# Altium project DT35_DataACQ_F3.PrjPcb
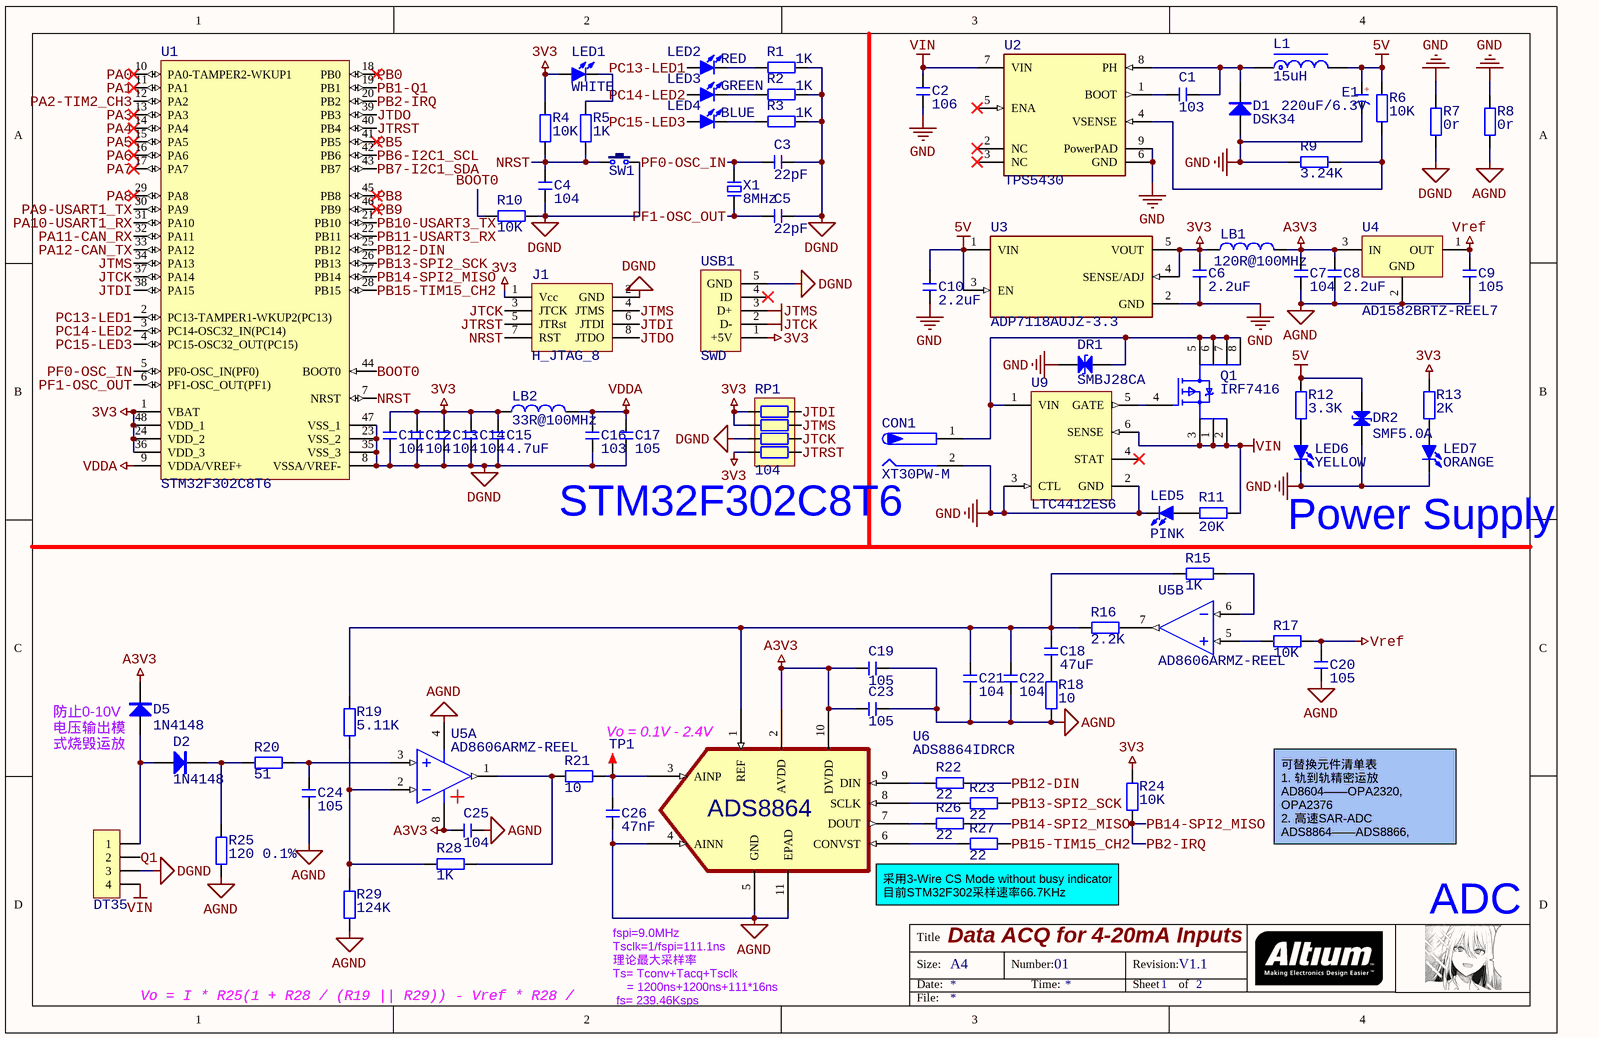
[diagram p0: Single_Supply_ADC_V1.1.SchDoc]
2 sheets, 122 parts. Net scope: global (net labels, ports and power ports of the same name join across sheets).
Board file: DT35_ACQ_F3_V1.2.PcbDoc
Sheets:
  Single_Supply_ADC_V1.1.SchDoc
  Communication_V1.1.SchDoc

## Sheet Single_Supply_ADC_V1.1.SchDoc: Data ACQ for 4-20mA Inputs
size A4; DrawnBy: Lin; Engineer: Lin; DocumentNumber: 01; Revision: V1.1; SheetNumber: 1; SheetTotal: 2

### Parts
C1  103  [C 0603_L]
C2  106  [C 0805_L]
C3  22pF  [C 0603_L]
C4  104  [C 0603_L]
C5  22pF  [C 0603_L]
C6  2.2uF  [C 0603_L]
C7  104  [C 0603_L]
C8  2.2uF  [C 0603_L]
C9  105  [C 0603_L]
C10  2.2uF  [C 0603_L]
C11  104  [C 0603_L]
C12  104  [C 0603_L]
C13  104  [C 0603_L]
C14  104  [C 0603_L]
C15  4.7uF  [C 0603_L]
C16  103  [C 0603_L]
C17  105  [C 0603_L]
C18  47uF  [C 0603_L]
C19  105  [C 0603_L]
C20  105  [C 0603_L]
C21  104  [C 0603_L]
C22  104  [C 0603_L]
C23  105  [C 0603_L]
C24  105  [C 0603_L]
C25  104  [C 0603_L]
C26  47nF  [C 0603_L]
CON1  XT30PW-M  [XT30PW-M]
D1  DSK34  [SOD-123]
D2  1N4148  [SOD-123]
D5  1N4148  [SOD-123]
DR1  SMBJ28CA  [SMB]
DR2  SMF5.0A  [SOD-323]
DT35  HDR-1X4  [XH2.54-LS-4P]  (value not drawn)
E1  220uF/6.3V  [CD B(3528)]
J1  H_JTAG_8  [IDC2.54-LI-2x4P]
L1  15uH  [NR4020]
LB1  120R@100MHz  [FB 0603_L]
LB2  33R@100MHz  [FB 0603_L]
LED1  WHITE  [LED 0603W]
LED2  RED  [LED 0603R]
LED3  GREEN  [LED 0603G]
LED4  BLUE  [LED 0603B]
LED5  PINK  [LED 0603R]
LED6  YELLOW  [LED 0603R]
LED7  ORANGE  [LED 0603R]
Q1  IRF7416  [SOP8_L]
R1  1K  [R 0603_L]
R2  1K  [R 0603_L]
R3  1K  [R 0603_L]
R4  10K  [R 0603_L]
R5  1K  [R 0603_L]
R6  10K  [R 0603_L]
R7  0r  [R 0603_L]
R8  0r  [R 0603_L]
R9  3.24K  [R 0603_L]
R10  10K  [R 0603_L]
R11  20K  [R 0603_L]
R12  3.3K  [R 0603_L]
R13  2K  [R 0603_L]
R15  1K  [R 0603_L]
R16  2.2K  [R 0603_L]
R17  10K  [R 0603_L]
R18  10  [R 0603_L]
R19  5.11K  [R 0603_L]
R20  51  [R 0603_L]
R21  10  [R 0603_L]
R22  22  [R 0603_L]
R23  22  [R 0603_L]
R24  10K  [R 0603_L]
R25  120 0.1%  [R 0603_L]
R26  22  [R 0603_L]
R27  22  [R 0603_L]
R28  1K  [R 0603_L]
R29  124K  [R 0603_L]
RP1  104  [RCA-8P4R-0603]
SW1  6x6x5  [TS 2PIN 6x6x4.8]  (value not drawn)
TP1  (no value)  [TEST 1]
U1  STM32F302C8T6  [LQFP48 7X7_L]
U2  TPS5430  [Texas_Instruments_DDA0008J_IPC_C]
U3  ADP7118AUJZ-3.3  [Analog_Devices_Inc_UJ-5_IPC_C]
U4  AD1582BRTZ-REEL7  [SOT23-3L]
U5  AD8606ARMZ-REEL  [RM_8_ADI-L]  (parts A,B of 2)
U6  ADS8864IDRCR  [DRC10_TEX]
U9  LTC4412ES6  [Texas_Instruments_DDC0006A_0]
USB1  SWD  [USB-MICRO_C]
X1  8MHz  [OSC 5032-2P]

### Nets
3V3: C6.1 C11.2 C12.2 C13.2 C14.2 C15.2 J1.1(Vcc) LB1.1 LB2.1 LED1.1(A) R4.2 R13.2 R24.2 RP1.5 RP1.6 RP1.8 U1.1(VBAT) U1.24(VDD_2) U1.36(VDD_3) U1.48(VDD_1) U3.4(SENSE/ADJ) U3.5(VOUT) USB1.1(+5V)
5V: C10.1 DR2.2(K) E1.1(A) L1.2 R6.2 R12.2 U3.1(VIN) U3.3(EN)
A3V3: C7.1 C8.1 C19.2 C23.2 C25.2 D5.2(K) LB1.2 U4.3(IN) U5.8(+V) U6.2(AVDD) U6.10(DVDD)
AGND: C7.2 C8.2 C9.2 C19.1 C20.1 C21.1 C22.1 C23.1 C24.1 C25.1 C26.2 R8.2 R18.1 R25.1 R29.1 U4.2(GND) U5.4(-V) U6.4(AINN) U6.5(GND) U6.11(EPAD)
DGND: C3.1 C4.1 C5.1 C11.1 C12.1 C13.1 C14.1 C15.1 C16.1 C17.1 DT35.3 J1.2(GND) R1.2 R2.2 R3.2 R7.2 R10.1 RP1.7 SW1.2 U1.8(VSSA/VREF-) U1.23(VSS_2) U1.35(VSS_3) U1.47(VSS_1) USB1.5(GND)
GND: C2.1 C6.2 C10.2 CON1.2 D1.1(A) DR1.2(K) DR2.1(A) E1.2(K) LED5.2(K) LED6.2(K) LED7.2(K) R7.1 R8.1 R9.2 U2.6(GND) U2.9(PowerPAD) U3.2(GND) U9.2(GND) U9.3(CTL)
JTCK: J1.3(JTCK) RP1.2 U1.37(PA14) USB1.2(D-)
JTMS: J1.4(JTMS) RP1.3 U1.34(PA13) USB1.3(D+)
VDDA: C16.2 C17.2 LB2.2 U1.9(VDDA/VREF+)
VIN: C2.2 DT35.4 Q1.1(S) Q1.2(S) Q1.3(S) R11.1 U2.7(VIN) U9.6(SENSE)
Vref: C9.1 C20.2 R17.1 U4.1(OUT)
BOOT0: R10.2 U1.44(BOOT0)
JTDI: J1.6(JTDI) RP1.4 U1.38(PA15)
JTDO: J1.8(JTDO) U1.39(PB3)
JTRST: J1.5(JTRst) RP1.1 U1.40(PB4)
NRST: C4.2 J1.7(RST) R4.1 R5.1 SW1.1 U1.7(NRST)
PA0: U1.10(PA0-TAMPER2-WKUP1)
PA1: U1.11(PA1)
PA2-TIM2_CH3: U1.12(PA2)
PA3: U1.13(PA3)
PA4: U1.14(PA4)
PA5: U1.15(PA5)
PA6: U1.16(PA6)
PA7: U1.17(PA7)
PA8: U1.29(PA8)
PA9-USART1_TX: U1.30(PA9)
PA10-USART1_RX: U1.31(PA10)
PA11-CAN_RX: U1.32(PA11)
PA12-CAN_TX: U1.33(PA12)
PB0: U1.18(PB0)
PB1-Q1: U1.19(PB1)
PB5: U1.41(PB5)
PB6-I2C1_SCL: U1.42(PB6)
PB7-I2C1_SDA: U1.43(PB7)
PB8: U1.45(PB8)
PB9: U1.46(PB9)
PB10-USART3_TX: U1.21(PB10)
PB11-USART3_RX: U1.22(PB11)
PB12-DIN: R22.1 U1.25(PB12)
PB13-SPI2_SCK: R23.1 U1.26(PB13)
PB14-SPI2_MISO: R24.1 R26.1 U1.20(PB2) U1.27(PB14)  [also labelled PB2-IRQ]
PB15-TIM15_CH2: R27.1 U1.28(PB15)
PC13-LED1: LED2.1(A) U1.2(PC13-TAMPER1-WKUP2(PC13))
PC14-LED2: LED3.1(A) U1.3(PC14-OSC32_IN(PC14))
PC15-LED3: LED4.1(A) U1.4(PC15-OSC32_OUT(PC15))
PF0-OSC_IN: C3.2 U1.5(PF0-OSC_IN(PF0)) X1.2
PF1-OSC_OUT: C5.2 U1.6(PF1-OSC_OUT(PF1)) X1.1
Q1: DT35.2
NetC1_1: C1.1 D1.2(K) L1.1 U2.8(PH)
NetC1_2: C1.2 U2.1(BOOT)
NetC18_1: C18.1 R18.2
NetC18_2: C18.2 C21.2 C22.2 R15.2 R16.2 R19.2 U6.1(REF)
NetC24_2: C24.2 R20.1 U5.3(+IN_A)
NetC26_1: C26.1 R21.1 TP1.1 U6.3(AINP)
NetCON1_1: CON1.1 DR1.1(A) Q1.5(D) Q1.6(D) Q1.7(D) Q1.8(D) U9.1(VIN)
NetD2_1: D2.1(A) D5.1(A) DT35.1
NetD2_2: D2.2(K) R20.2 R25.2
NetLED1_2: LED1.2(K) R5.2
NetLED2_2: LED2.2(K) R1.1
NetLED3_2: LED3.2(K) R2.1
NetLED4_2: LED4.2(K) R3.1
NetLED5_1: LED5.1(A) R11.2
NetLED6_1: LED6.1(A) R12.1
NetLED7_1: LED7.1(A) R13.1
NetQ1_4: Q1.4(G) U9.5(GATE)
NetR6_1: R6.1 R9.1 U2.4(VSENSE)
NetR15_1: R15.1 U5.6(-IN_B)
NetR16_1: R16.1 U5.7(OUT_B)
NetR17_2: R17.2 U5.5(+IN_B)
NetR19_1: R19.1 R28.2 R29.2 U5.2(-IN_A)
NetR21_2: R21.2 R28.1 U5.1(OUT_A)
NetR22_2: R22.2 U6.9(DIN)
NetR23_2: R23.2 U6.8(SCLK)
NetR26_2: R26.2 U6.7(DOUT)
NetR27_2: R27.2 U6.6(CONVST)

Not connected (* = marked no-connect by the designer): U2 2(NC)* 3(NC)* 5(ENA)*; U9 4(STAT)*; USB1 4(ID)*

### Notes on the sheet
- STM32F302C8T6
- Power Supply
- (near D5) 防止0-10V电压输出模式烧毁运放
- (near U6) Vo = 0.1V - 2.4V
- 可替换元件清单表
  1. 轨到轨精密运放
  AD8604——OPA2320, OPA2376
  2. 高速SAR-ADC
  ADS8864——ADS8866, ADS8862, ADS8860
- (near U6) 采用3-Wire CS Mode without busy indicator
  目前STM32F302采样速率66.7KHz
- ADC
- Vo = I * R25(1 + R28 / (R19 || R29)) - Vref * R28 / R19
- fspi=9.0MHz
  Tsclk=1/fspi=111.1ns
  理论最大采样率
  Ts= Tconv+Tacq+Tsclk
  = 1200ns+1200ns+111*16ns
  fs= 239.46Ksps
- Title
- Size:
- Date:
- A4
- Number:
- Time:
- Revision:
- Sheet
- of
- File:
- (in symbol ADS8864IDRCR) ADS8864
- (in symbol C-CD) +

### Library data of the parts
C1-C26 = C: 无极性贴片电容; 材质: X7R; BOM名称: 无极性贴片电容
CON1 = XT30PW-M: XT30PW-M PCB板专用卧式连接器，低温升阻燃插头
D1 = 1N5819: 肖特基二极管; 属性: 40V/2A; BOM名称: 肖特基二极管
D2 D5 = 1N4148: 高速开关二极管; BOM名称: 高速开关二极管
DR1 DR2 = DR: 瞬态电压抑制二极管; BOM名称: 瞬态电压抑制二极管
DT35 = Header 4: 4P接插件; BOM名称: 4P接插件
E1 = C-CD: 贴片钽电容; BOM名称: 贴片钽电容
J1 = H_JTAG_8: 8脚JTAG下载接口
L1 = L-NR: NR磁胶电感; BOM名称: NR磁胶电感
LB1 LB2 = LB: 磁珠; BOM名称: 磁珠
LED1-LED7 = LED-SMD: 贴片LED; BOM名称: 贴片LED
Q1 = IRF7416TRPBF: Mosfet Transistor, P Channel, -10 A, -30 V, 20 Mohm, 10 V, -1 V
R1-R13 R15-R29 = R: 贴片电阻; BOM名称: 贴片电阻
RP1 = R-8P4R: 贴片网络排阻; BOM名称: 贴片网络排阻
SW1 = TSW SMD-2Pin-6x6: 2脚贴片6x6无声硅胶轻触开关; BOM名称: 2脚轻触开关
TP1 = TEST: 测试点; BOM名称: 测试点
U1 = STM32F302C8T6: ARM Cortex-M4 32-bit MCU, 64 KB Flash, 16 KB Internal RAM, 37 I/Os, 48-Pin LQFP, -40 to 85 degC, Tray; Operating Frequency(F) (Processor speed) (MHz): 72; FLASH Size (Prog) (kB): 64; D/A Converter: 1; I/Os (High Current): 37; Internal RAM Size (kB): 16; Supply Voltage(Vcc) min (V): 2; ComponentLink1Description: Manufacturer URL; ComponentLink2Description: Datasheet; Core: ARM Cortex-M4; DatasheetVersion: Rev. 5; ComponentLink1URL: http://www.st.com/; Package Description: 48-Pin Low Profile Quad Flat Package, Body 7 x 7 mm, Pitch 0.5 mm; Packing: Tray; Mounting Technology: Surface Mount; ComponentLink2URL: http://www.st.com/st-web-ui/static/active/en/resource/technical/document/datasheet/DM00093333.pdf; Package Reference: LQFP48; PartNumber: STM32F302C8T6
U2 = TPS5430DDA: 5.5V to 36V Input, 3A, 500kHz Step-Down Converter 8-SO PowerPAD 0 to 0
U3 = ADP7118AUJZ-3.3-R7: 20 V, 200 mA, Low Noise, / CMOS LDO Linear Regulator
U4 = AD1582BRTZ-REEL7: Micropower, Precision Series Mode Voltage Reference, 2.5 V Output, 2.7 to 12 V Supply, Industrial, 3-pin SOT23 (RT-3), Reel; Manufacturer: Analog Devices; Ref Out TC (ppm/C): 18; Vout: 2.5V; ComponentLink1Description: Manufacturer URL; DatasheetVersion: Rev. I; Mounting Technology: Surface Mount; ComponentLink3URL: http:/www.analog.com/static/imported-files/packages/PKG_PDF/SOT-23-3 (RT)/RT_3.pdf; ComponentLink3Description: Package Specification; ComponentLink1URL: http://www.analog.com/en/index.html; Packing: Reel; PackageReference: RT-3; ComponentLink2URL: http://www.analog.com/static/imported-files/data_sheets/AD1582_1583_1584_1585.pdf; Code_JEDEC: TO-236-AB; Operating Temp Range: -40 to 125 degC; PackageVersion: 011909-C, 02/2009; ComponentLink2Description: Datasheet; PartNumber: AD1582BRTZ-REEL7; ComponentLink4URL: Product URL:http://www.analog.com/en/special-linear-functions/voltage-references/ad1582/products/product.html; PackageDescription: 3-Pin Small Outline Transistor Package, Body 2.9 x 1.3 mm, Pitch 0.96 mm; ComponentLink4Description: URL Link1
U5 = AD8606ARMZ-REEL: Double Channel Wide Bandwidth Operational Amplifier, 10 MHz BW, 5 V/us SR, Industrial, 8-pin SOP (RM-8), Reel; Generic Part Number: AD8606; Manufacturer: Analog Devices; Amplifiers Per Package: 2; Small Signal Bandwidth: 10MHz; V Span Min: 2.7V; Iq/Amp: 1.2mA; Input Bias Current: 200fA; V Span Max: 6V; Input Offset Voltage: 20uV; Slew Rate: 5V/us; ComponentLink4Description: URL Link1; PartNumber: AD8606ARMZ-REEL; ComponentLink1Description: Manufacturer URL; ComponentLink2Description: Datasheet; DatasheetVersion: Rev. L; ComponentLink3URL: http://www.analog.com/static/imported-files/packages/PKG_PDF/MSOP%28RM%29/RM_8.pdf; ComponentLink3Description: Package Specification; ComponentLink1URL: http://www.analog.com/en/index.html; Code_JEDEC: MO-187-AA; ComponentLink4URL: Reference Circuit:http://www.analog.com/en/all-operational-amplifiers-op-amps/operational-amplifiers-op-amps/ad8606/products/product.html#product-recommendations; ComponentLink2URL: http://www.analog.com/static/imported-files/data_sheets/AD8605_8606_8608.pdf; PackageReference: RM-8; Mounting Technology: Surface Mount; PackageDescription: 8-Pin Mini Small Outline Package, Body 3 x 3 mm, Pitch 0.65 mm
U6 = ADS8864IDRCR: 16-Bit, 400-kSPS, 1-Ch SAR ADC with single-ended input, SPI interface and daisy-chain 10-VSON -40 to 85; Mfr_Name: Texas Instruments; Copyright: Copyright (C) 2022 Ultra Librarian. All rights reserved.; Manufacturer_Part_Number: ADS8864IDRCR; RefDes: RefDes; Type: DEV
U9 = LTC4412ES6#TRPBF: Low Loss PowerPath(TM) Controller, 2.5 to 28 V Vin, 6-pin SOT23 (S6-6), -40 to 85 degC, Pb-Free, Tape and Reel; Manufacturer: Linear Technology; Ideal Diode: Single, External, P-Channel; ComponentLink1Description: Manufacturer URL; ComponentLink2Description: Datasheet; ComponentLink3Description: Package Specification; Mounting Technology: Surface Mount; ComponentLink3URL: http://cds.linear.com/docs/en/packaging/SOT_6_05-08-1636.pdf; ComponentLink1URL: http://www.linear.com/; ComponentLink2URL: http://cds.linear.com/docs/en/datasheet/4412fa.pdf; Code_JEDEC: MO-193; Packing: Tape and Reel; PartNumber: LTC4412ES6#TRPBF; PackageDescription: 6-Pin Plastic TSOT-23, Body 2.9 x 1.63 mm, Pitch 0.95 mm; PackageVersion: Jun-10; RoHS: TRUE; PackageReference: S6-6
USB1 = USB-5P: 微型USB母座; BOM名称: 微型USB母座
X1 = XTAL-2P: 2脚无源脚晶振; 负载电容: CL20pF; BOM名称: 2脚无源脚晶振

## Sheet Communication_V1.1.SchDoc: Data ACQ for 4-20mA Inputs
size A4; DrawnBy: Lin; Engineer: Lin; DocumentNumber: 02; Revision: V1.1; SheetNumber: 2; SheetTotal: 2
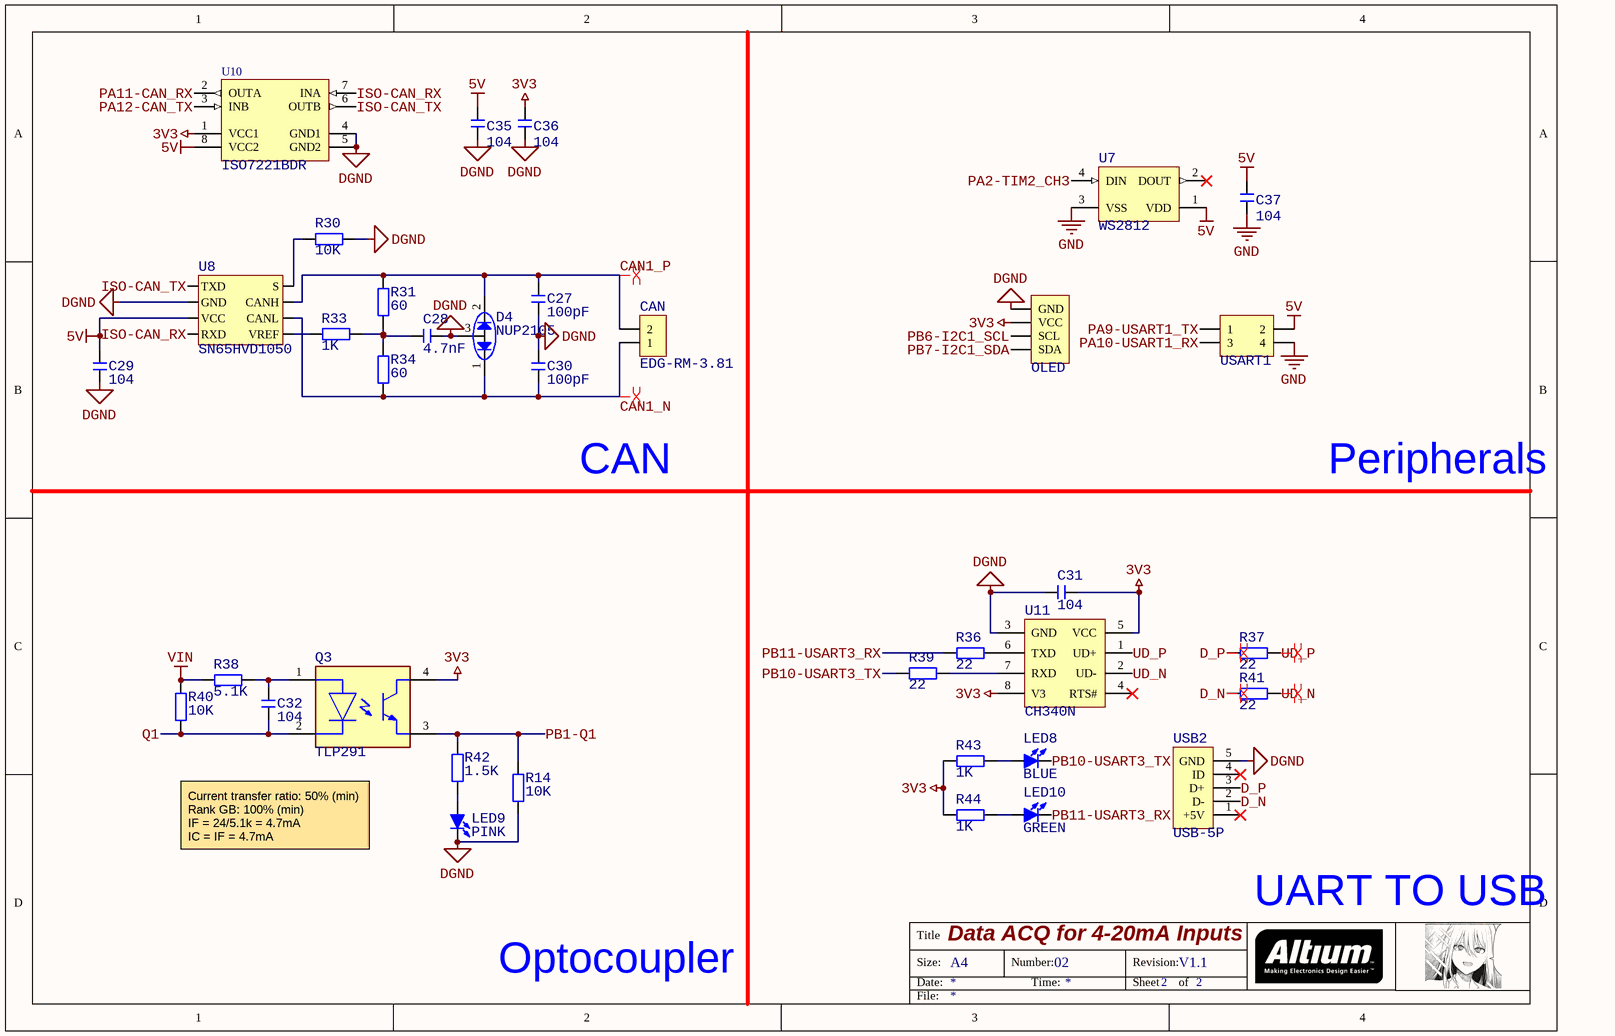
[diagram p1: Communication_V1.1.SchDoc]

### Parts
C27  100pF  [C 0603_L]
C28  4.7nF  [C 0603_L]
C29  104  [C 0603_L]
C30  100pF  [C 0603_L]
C31  104  [C 0603_L]
C32  104  [C 0603_L]
C35  104  [C 0603_L]
C36  104  [C 0603_L]
C37  104  [C 0603_L]
CAN  EDG-RM-3.81  [15EDGRM-02P-3.81mm]
D4  NUP2105  [SOT23-3L]
LED8  BLUE  [LED 0603B]
LED9  PINK  [LED 0603R]
LED10  GREEN  [LED 0603G]
OLED  HDR-1X4  [OLED_0.96寸-LI-4P]  (value not drawn)
Q3  TLP291  [Everlight_EL3H7-G_MFG]
R14  10K  [R 0603_L]
R30  10K  [R 0603_L]
R31  60  [R 0603_L]
R33  1K  [R 0603_L]
R34  60  [R 0603_L]
R36  22  [R 0603_L]
R37  22  [R 0603_L]
R38  5.1K  [R 0603_L]
R39  22  [R 0603_L]
R40  10K  [R 0603_L]
R41  22  [R 0603_L]
R42  1.5K  [R 0603_L]
R43  1K  [R 0603_L]
R44  1K  [R 0603_L]
U7  WS2812  [WS2812B_B]
U8  SN65HVD1050  [SOP8_L]
U10  ISO7221BDR  [SOP8_L]
U11  CH340N  [SOP8_N]
USART1  Header2X2  [HDR2.54-M-LS-2x2P]  (value not drawn)
USB2  USB-5P  [USB-MICRO_E]

### Nets
3V3: C31.1 C36.1 OLED.2(VCC) Q3.4(C) R43.1 R44.1 U10.1(VCC1) U11.5(VCC) U11.8(V3)
5V: C29.2 C35.1 C37.1 U7.1(VDD) U8.3(VCC) U10.8(VCC2) USART1.2
DGND: C27.1 C28.2 C29.1 C30.2 C31.2 C35.2 C36.2 D4.3 LED9.2(K) OLED.1(GND) R14.2 R30.2 U8.2(GND) U10.4(GND1) U10.5(GND2) U11.3(GND) USB2.5(GND)
GND: C37.2 U7.3(VSS) USART1.4
VIN: R38.2 R40.1
CAN1_N: C30.1 CAN.1 D4.1 R34.1 U8.6(CANL)
CAN1_P: C27.2 CAN.2 D4.2 R31.2 U8.7(CANH)
D_N: R41.1 USB2.2(D-)
D_P: R37.1 USB2.3(D+)
ISO-CAN_RX: U8.4(RXD) U10.7(INA)
ISO-CAN_TX: U8.1(TXD) U10.6(OUTB)
PA2-TIM2_CH3: U7.4(DIN)
PA9-USART1_TX: USART1.1
PA10-USART1_RX: USART1.3
PA11-CAN_RX: U10.2(OUTA)
PA12-CAN_TX: U10.3(INB)
PB1-Q1: Q3.3(E) R14.1 R42.1
PB6-I2C1_SCL: OLED.3(SCL)
PB7-I2C1_SDA: OLED.4(SDA)
PB10-USART3_TX: LED8.2(K) R39.1
PB11-USART3_RX: LED10.2(K) R36.1
Q1: C32.2 Q3.2(C) R40.2
UD_N: R41.2 U11.2(UD-)
UD_P: R37.2 U11.1(UD+)
NetC28_1: C28.1 R31.1 R33.1 R34.2
NetC32_1: C32.1 Q3.1(A) R38.1
NetLED8_1: LED8.1(A) R43.2
NetLED9_1: LED9.1(A) R42.2
NetLED10_1: LED10.1(A) R44.2
NetR30_1: R30.1 U8.8(S)
NetR33_2: R33.2 U8.5(VREF)
NetR36_2: R36.2 U11.6(TXD)
NetR39_2: R39.2 U11.7(RXD)

Not connected (* = marked no-connect by the designer): U7 2(DOUT)*; U11 4(RTS#)*; USB2 1(+5V)* 4(ID)*

### Layout directives
differential pair: CAN1_N, CAN1_P, D_N, D_P, UD_N, UD_P

### Notes on the sheet
- CAN
- Peripherals
- Current transfer ratio: 50% (min)
  Rank GB: 100% (min)
  IF = 24/5.1k = 4.7mA
  IC = IF = 4.7mA
- UART TO USB
- Optocoupler
- Title
- Size:
- Date:
- A4
- Number:
- Time:
- Revision:
- Sheet
- of
- File:

### Library data of the parts
C27-C32 C35-C37 = C: 无极性贴片电容; 材质: X7R; BOM名称: 无极性贴片电容
CAN = 绿头卧式2P: 3.81间距
D4 = BAT54A: 表贴肖特基二极管; BOM名称: 肖特基二极管; 属性: 30V/0.2A
LED8-LED10 = LED-SMD: 贴片LED; BOM名称: 贴片LED
OLED = OLED_I2C_128*64: OLED-4P接插件; BOM名称: 4P接插件
Q3 = EL3H7_C_TA_-VG: Optocoupler DC-IN 1-CH Transistor DC-OUT 4-Pin SSOP T/R
R14 R30 R31 R33 R34 R36-R44 = R: 贴片电阻; BOM名称: 贴片电阻
U7 = WS2812: Intelligent Control LED Integrated Light Source, 3.5 to 5.3 V, -25 to 80 degC, 4-Pin SMD, RoHS, Bulk; PartNumber: WS2812B; Current Rating: 240 mA; Tolerance: 10%; Shielding: Unshielded; Case\Package: Radial; RoHSCompliant: true; Min Operating Temperature: -55 degC; Max Operating Temperature: 125 degC; Pins: 2; REACH SVHC: No SVHC; ComponentLink2Description: Datasheet; DatasheetVersion: May-13; ComponentLink1URL: https://www.adafruit.com/; ComponentLink2URL: https://cdn-shop.adafruit.com/datasheets/WS2812B.pdf; PackageReference: WS2812B; ComponentLink1Description: Manufacturer URL; Mount: Through Hole; Length: 12.2 mm; Radiation Hardening: No; Lead Pitch: 5 mm; Package Quantity: 200; Height: 12.2 mm; Packaging: Bulk; PackageDescription: 4-Pin Surface Mount Device, Body 5 x 5 mm, Pitch 3.3 mm
U8 = SN65HVD1050: EMC Optimized CAN Bus Transceiver
U10 = ISO7221BDR: 5 Mbps Dual Channels, 1 / 1, Digital Isolator, 3.3 V / 5 V, -40 to +125 degC, 8-pin SOIC (D), Green (RoHS & no Sb/Br); Manufacturer: Texas Instruments; Supply Voltage(s)(V): 3.3, 5; Insulation Rating(VRMS): 2500; TTL/CMOS Input Threshold: TTL; Rating: Catalog; Input Noise Filter: Yes; Datarate(Mbps): 5; Eco-Plan: Green (RoHS & no Sb/Br); PartNumber: ISO7221BDR; SubFamily: Isolator; ComponentLink1Description: Datasheet; ComponentLink2Description: URL Link1; DatasheetVersion: SLLS755L; ComponentLink1URL: http://www.ti.com/general/docs/lit/getliterature.tsp?genericPartNumber=ISO7221B&fileType=pdf; Code_JEDEC: MS-012AA; ComponentLink2URL: SamplesURL:http://www.ti.com/product/iso7221b#samples; PackageVersion: revM, Jun-2011; Channel Configuration: 02/01/2000; Thermal Shutdown: No; Mounting Technology: Surface Mount; PackageReference: D8; PackageDescription: 8-Pin Plastic Small Outline Integrated Circuit, 4.9 x 3.9 mm, Pitch 1.27 mm Pitch
U11 = CH340N: USB转串口芯片 / Full speed USB 2.0; PartNumber: TPS54232D; Manufacturer: Texas Instruments; Iq(Typ)(mA): 0.11; Vin(Min)(V): 3.5; Switch Current Limit(Typ)(A): 2.3; Eco-Plan: Green (RoHS & no Sb/Br); Duty Cycle(Max)(%): 90; SubFamily: Step-Down Regulator; Vout(Min)(V): 0.8; Vin(Max)(V): 28; Regulated Outputs(#): 1; Rating: Catalog; Vout(Max)(V): 25; Iout(Max)(A): 2; Topology: Buck; PackageReference: D8; ComponentLink1Description: Datasheet; ComponentLink2Description: URL Link1; DatasheetVersion: SLVS876B; ComponentLink1URL: http://www.ti.com/general/docs/lit/getliterature.tsp?genericPartNumber=TPS54232&fileType=pdf; Code_JEDEC: MS-012AA; ComponentLink2URL: Samples URL:http://www.ti.com/product/tps54232#samples; PackageVersion: revM, Jun-2011; Mounting Technology: Surface Mount; PackageDescription: 8-Pin Plastic Small Outline Integrated Circuit, 4.9 x 3.9 mm, Pitch 1.27 mm Pitch
USART1 = Header 2X2: 2*2P接插件; BOM名称: 2*2P接插件
USB2 = USB-5P: 微型USB母座; BOM名称: 微型USB母座

## Nets that join several sheets
3V3: Single_Supply_ADC_V1.1 (23 pins), Communication_V1.1 (9 pins)
5V: Single_Supply_ADC_V1.1 (8 pins), Communication_V1.1 (7 pins)
DGND: Single_Supply_ADC_V1.1 (24 pins), Communication_V1.1 (17 pins)
GND: Single_Supply_ADC_V1.1 (19 pins), Communication_V1.1 (C37.2 U7.3 USART1.4)
VIN: Single_Supply_ADC_V1.1 (8 pins), Communication_V1.1 (R38.2 R40.1)
PA2-TIM2_CH3: Single_Supply_ADC_V1.1 (U1.12), Communication_V1.1 (U7.4)
PA9-USART1_TX: Single_Supply_ADC_V1.1 (U1.30), Communication_V1.1 (USART1.1)
PA10-USART1_RX: Single_Supply_ADC_V1.1 (U1.31), Communication_V1.1 (USART1.3)
PA11-CAN_RX: Single_Supply_ADC_V1.1 (U1.32), Communication_V1.1 (U10.2)
PA12-CAN_TX: Single_Supply_ADC_V1.1 (U1.33), Communication_V1.1 (U10.3)
PB1-Q1: Single_Supply_ADC_V1.1 (U1.19), Communication_V1.1 (Q3.3 R14.1 R42.1)
PB6-I2C1_SCL: Single_Supply_ADC_V1.1 (U1.42), Communication_V1.1 (OLED.3)
PB7-I2C1_SDA: Single_Supply_ADC_V1.1 (U1.43), Communication_V1.1 (OLED.4)
PB10-USART3_TX: Single_Supply_ADC_V1.1 (U1.21), Communication_V1.1 (LED8.2 R39.1)
PB11-USART3_RX: Single_Supply_ADC_V1.1 (U1.22), Communication_V1.1 (LED10.2 R36.1)
Q1: Single_Supply_ADC_V1.1 (DT35.2), Communication_V1.1 (C32.2 Q3.2 R40.2)